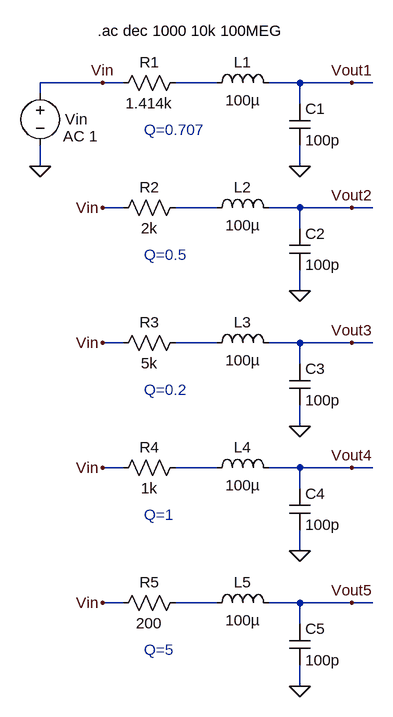
[diagram p0: schematic _Fig3_37_MSD.asc]
_Fig3_37_MSD.asc, the LTspice schematic file:
Version 4
SHEET 1 2740 696
WIRE 432 -336 432 -352
WIRE 432 -224 432 -256
WIRE 528 -352 432 -352
WIRE 560 -352 528 -352
WIRE 560 -160 528 -160
WIRE 560 48 528 48
WIRE 560 240 528 240
WIRE 560 448 528 448
WIRE 704 -352 640 -352
WIRE 704 -160 640 -160
WIRE 704 48 640 48
WIRE 704 240 640 240
WIRE 704 448 640 448
WIRE 832 -352 784 -352
WIRE 832 -320 832 -352
WIRE 832 -224 832 -256
WIRE 832 -160 784 -160
WIRE 832 -128 832 -160
WIRE 832 -32 832 -64
WIRE 832 48 784 48
WIRE 832 80 832 48
WIRE 832 176 832 144
WIRE 832 240 784 240
WIRE 832 272 832 240
WIRE 832 368 832 336
WIRE 832 448 784 448
WIRE 832 480 832 448
WIRE 832 576 832 544
WIRE 912 -352 832 -352
WIRE 912 -160 832 -160
WIRE 912 48 832 48
WIRE 912 240 832 240
WIRE 912 448 832 448
WIRE 944 -352 912 -352
WIRE 944 -160 912 -160
WIRE 944 48 912 48
WIRE 944 240 912 240
WIRE 944 448 912 448
FLAG 432 -224 0
FLAG 832 -224 0
FLAG 912 -352 Vout1
FLAG 528 -352 Vin
FLAG 832 -32 0
FLAG 912 -160 Vout2
FLAG 528 -160 Vin
FLAG 832 176 0
FLAG 912 48 Vout3
FLAG 528 48 Vin
FLAG 832 368 0
FLAG 912 240 Vout4
FLAG 528 240 Vin
FLAG 832 576 0
FLAG 912 448 Vout5
FLAG 528 448 Vin
SYMBOL voltage 432 -352 R0
WINDOW 0 38 56 Left 0
WINDOW 123 35 82 Left 0
WINDOW 39 0 0 Left 0
SYMATTR InstName Vin
SYMATTR Value2 AC 1
SYMATTR Value ""
SYMBOL ind 800 -336 M270
WINDOW 0 32 56 VTop 0
WINDOW 3 5 56 VBottom 0
SYMATTR InstName L1
SYMATTR Value 100µ
SYMBOL res 544 -336 R270
WINDOW 0 32 56 VTop 0
WINDOW 3 0 56 VBottom 0
SYMATTR InstName R1
SYMATTR Value 1.414k
SYMBOL cap 816 -320 R0
SYMATTR InstName C1
SYMATTR Value 100p
SYMBOL ind 800 -144 M270
WINDOW 0 32 56 VTop 0
WINDOW 3 5 56 VBottom 0
SYMATTR InstName L2
SYMATTR Value 100µ
SYMBOL res 544 -144 R270
WINDOW 0 32 56 VTop 0
WINDOW 3 0 56 VBottom 0
SYMATTR InstName R2
SYMATTR Value 2k
SYMBOL cap 816 -128 R0
SYMATTR InstName C2
SYMATTR Value 100p
SYMBOL ind 800 64 M270
WINDOW 0 32 56 VTop 0
WINDOW 3 5 56 VBottom 0
SYMATTR InstName L3
SYMATTR Value 100µ
SYMBOL res 544 64 R270
WINDOW 0 32 56 VTop 0
WINDOW 3 0 56 VBottom 0
SYMATTR InstName R3
SYMATTR Value 5k
SYMBOL cap 816 80 R0
SYMATTR InstName C3
SYMATTR Value 100p
SYMBOL ind 800 256 M270
WINDOW 0 32 56 VTop 0
WINDOW 3 5 56 VBottom 0
SYMATTR InstName L4
SYMATTR Value 100µ
SYMBOL res 544 256 R270
WINDOW 0 32 56 VTop 0
WINDOW 3 0 56 VBottom 0
SYMATTR InstName R4
SYMATTR Value 1k
SYMBOL cap 816 272 R0
SYMATTR InstName C4
SYMATTR Value 100p
SYMBOL ind 800 464 M270
WINDOW 0 32 56 VTop 0
WINDOW 3 5 56 VBottom 0
SYMATTR InstName L5
SYMATTR Value 100µ
SYMBOL res 544 464 R270
WINDOW 0 32 56 VTop 0
WINDOW 3 0 56 VBottom 0
SYMATTR InstName R5
SYMATTR Value 200
SYMBOL cap 816 480 R0
SYMATTR InstName C5
SYMATTR Value 100p
TEXT 520 -432 Left 0 !.ac dec 1000 10k 100MEG
TEXT 592 -280 Left 0 ;Q=0.707
TEXT 592 -88 Left 0 ;Q=0.5
TEXT 592 120 Left 0 ;Q=0.2
TEXT 592 312 Left 0 ;Q=1
TEXT 592 520 Left 0 ;Q=5

The netlist it stands for:
* _Fig3_37_MSD.asc
Vin Vin 0 AC 1
L1 Vout1 N001 100µ
R1 Vin N001 1.414k
C1 Vout1 0 100p
L2 Vout2 N002 100µ
R2 Vin N002 2k
C2 Vout2 0 100p
L3 Vout3 N003 100µ
R3 Vin N003 5k
C3 Vout3 0 100p
L4 Vout4 N004 100µ
R4 Vin N004 1k
C4 Vout4 0 100p
L5 Vout5 N005 100µ
R5 Vin N005 200
C5 Vout5 0 100p
.ac dec 1000 10k 100MEG
* Q=0.707
* Q=0.5
* Q=0.2
* Q=1
* Q=5
.backanno
.end